# EAGLE design UPC2standalone2_Vadriano_capacitor_entrada (EAGLE 6.1)
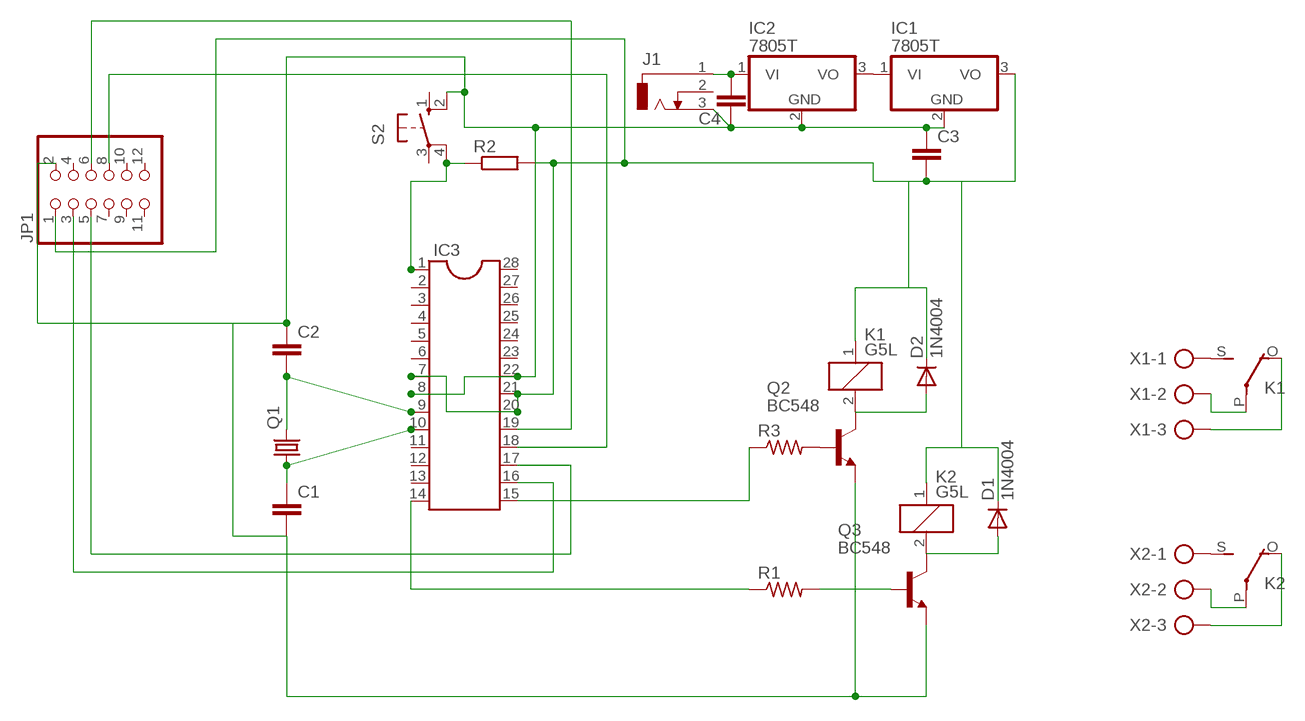
[diagram p0: schematic, sheet 1]

## Parts
C1  C5/5  [C5B5]
C2  C5/5  [C5B5]
C3  C5/5  [C5B5]
C4  C5/5  [C5B5]
D1  1N4004  [DO41-10]
D2  1N4004  [DO41-10]
IC1  7805T  [TO220H]
IC2  7805T  [TO220H]
IC3  DIL28-3  [DIL28-3]
J1  DCJ0303  [DCJ0303]
JP1  PINHD-2X6  [2X06]
K1  G5L  [G5LE]
K2  G5L  [G5LE]
Q1  CRYSTALHC49U70  [HC49U70]
Q2  BC548  [TO92-EBC]
Q3  BC548  [TO92-EBC]
R1  R-US_0207/10  [0207/10]
R2  R-EU_0207/10  [0207/10]
R3  R-US_0207/10  [0207/10]
S2  10-XX  [B3F-10XX]
X1  AK300/3  [AK300/3]
X2  AK300/3  [AK300/3]

## Nets
GND: C1.2 C2.1 C3.1 C4.1 IC1.2(GND) IC2.2(GND) IC3.8 IC3.22 J1.3 JP1.2 Q2.E Q3.E S2.2(S1)
N$1: IC3.18 JP1.8
N$2: C1.1 IC3.10 Q1.1
N$3: IC3.1 R2.1 S2.4(P1)
N$4: Q2.B R3.2
N$6: D2.A K1.2 Q2.C
N$7: IC3.16 JP1.3
N$8: IC3.19 JP1.6
N$9: IC3.17 JP1.5
N$10: D1.A K2.2 Q3.C
N$11: Q3.B R1.2
N$13: IC3.15 R3.1
N$14: IC1.1(VI) IC2.3(VO)
N$15: C3.2 D1.C D2.C IC1.3(VO) IC3.7 IC3.20 IC3.21 JP1.1 K1.1 K2.1 R2.2
N$17: IC3.14 R1.1
N$18: K1.S(2:S) X1.1
N$19: K2.S(2:S) X2.1
N$20: K2.P(2:P) X2.2
N$21: K2.O(2:O) X2.3
N$22: K1.P(2:P) X1.2
N$23: K1.O(2:O) X1.3
N$24: C4.2 IC2.1(VI) J1.1
N$27: C2.2 IC3.9 Q1.2
Unconnected: IC3.2 IC3.3 IC3.4 IC3.5 IC3.6 IC3.11 IC3.12 IC3.13 IC3.23 IC3.24 IC3.25 IC3.26 IC3.27 IC3.28 J1.2 JP1.4 JP1.7 JP1.9 JP1.10 JP1.11 JP1.12 S2.1(S) S2.3(P)

## Library data of the parts
C1-C4 = capacitor-wima:C: CAPACITOR naming: grid - package width
D1 D2 = adafruit:1N4004: DIODE General purpose 1N400x type rectifier (With bigger pads) http://www.ladyada.net/library/pcb/eaglelibrary.html
IC1 IC2 = linear:78*: Positive VOLTAGE REGULATOR Source: http://cache.national.com/ds/LM/LM78L05.pdf http://www.fairchildsemi.com/ds/LM/LM7805.pdf
IC3 = ic-package:DIL28: Dual In Line
J1 = con-jack:DCJ0303: DC POWER JACK Source: DCJ0303.pdf
JP1 = pinhead:PINHD-2X6: PIN HEADER
K1 K2 = relay:G5L: RELAY 1 x switch, 10 A/120 V AC, 8 A/30 V ADC, Omron
Q1 = crystal:CRYSTAL: CRYSTAL
Q2 Q3 = transistor-npn:BC548*: NPN Transistor
R1 R3 = adafruit:R-US_: RESISTOR, American symbol
R2 = rcl:R-EU_: RESISTOR, European symbol
S2 = switch-omron:10-XX: OMRON SWITCH
X1 X2 = con-ptr500:AK300/3: CONNECTOR

## Board
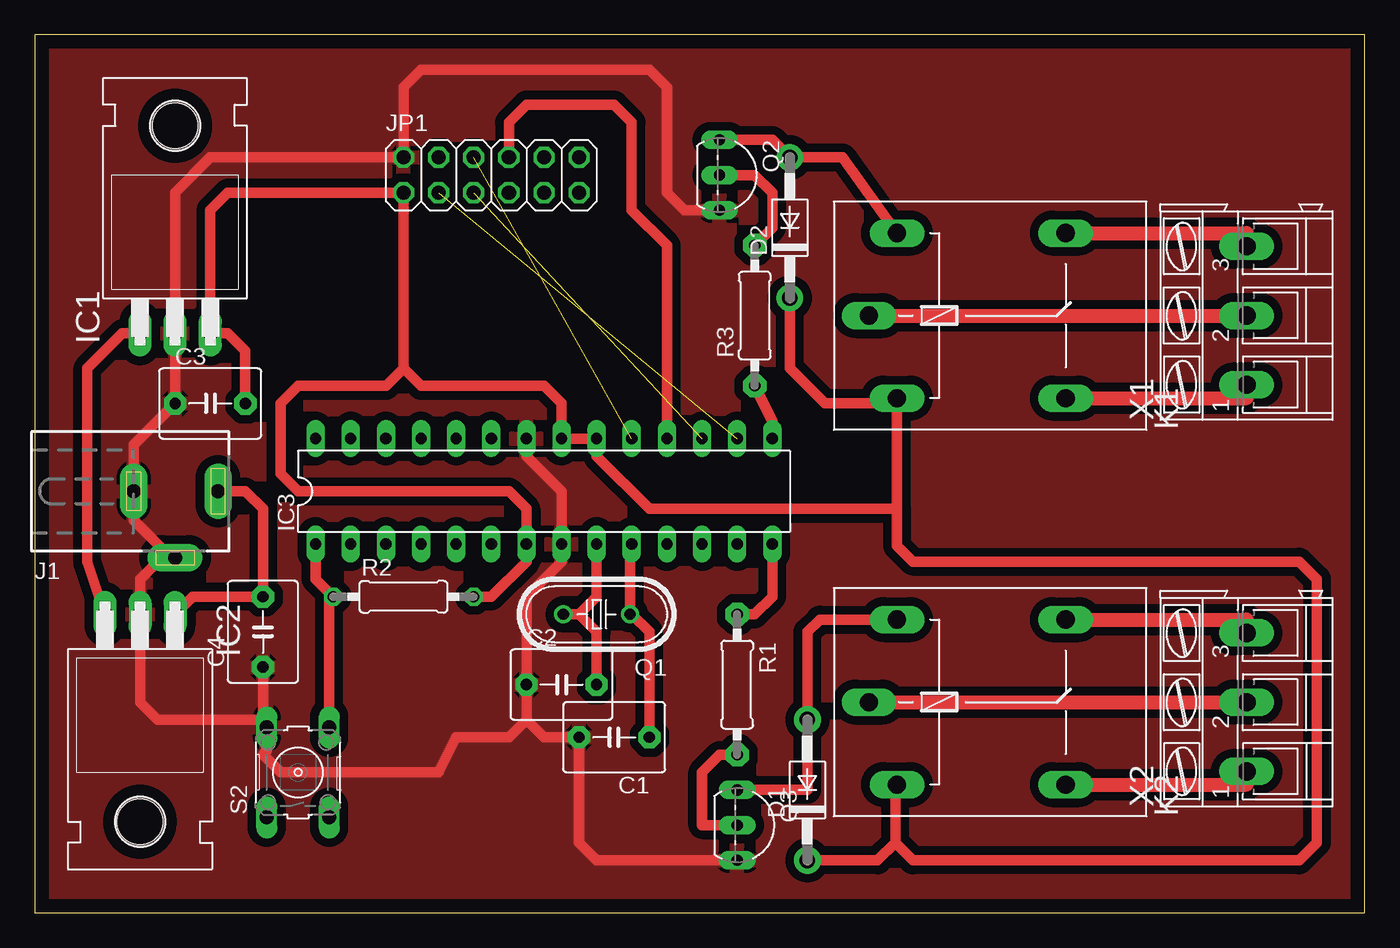
[diagram p1: board, top side]

Size 96.19 x 63.49 mm. Coordinates in mm from the lower left corner, seen from the top.
Outline: 0,0 96.19,0 96.19,63.49 0,63.49 0,0
Copper layers (1*16): Top 0.035mm / dielectric 1.5mm / Bottom 0.035mm
Design rules: minimum track width 30mil, minimum drill 24mil, track to track 25mil, track to pad 25mil, pad to pad 25mil, via to via 25mil, smd to smd 8mil, copper to edge 40mil, drill to drill 8mil, minimum pad ring 10mil, minimum via ring 8mil, stop-mask expansion 4mil, vias tented up to drill 0mil, thermal gap 10mil

### Footprints (pad centres in the part's own frame; a part is rotated, then mirrored left to right if it is on the bottom)
C5B5 = drill 0.813 pad 1.6 octagon: 1 -2.54,0; 2 2.54,0
DO41-10 = drill 1.118 pad 1.93: A 5.08,0; C -5.08,0
TO220H = drill 1.118 long: 1 -2.54,-10.16; 2 0,-10.16; 3 2.54,-10.16 | hole 3.302: 0,4.826
DIL28-3 = drill 0.813 long: 1 -16.51,-3.81; 2 -13.97,-3.81; 3 -11.43,-3.81; 4 -8.89,-3.81; 5 -6.35,-3.81; 6 -3.81,-3.81; 7 -1.27,-3.81; 8 1.27,-3.81; 9 3.81,-3.81; 10 6.35,-3.81; 11 8.89,-3.81; 12 11.43,-3.81; 13 13.97,-3.81; 14 16.51,-3.81; 15 16.51,3.81; 16 13.97,3.81; 17 11.43,3.81; 18 8.89,3.81; 19 6.35,3.81; 20 3.81,3.81; 21 1.27,3.81; 22 -1.27,3.81; 23 -3.81,3.81; 24 -6.35,3.81; 25 -8.89,3.81; 26 -11.43,3.81; 27 -13.97,3.81; 28 -16.51,3.81
DCJ0303 = drill 1 pad 2 long: 1 0,3.1; 2 4.8,0; 3 0,-3
2X06 = drill 1.016 octagon: 1 -6.35,-1.27; 2 -6.35,1.27; 3 -3.81,-1.27; 4 -3.81,1.27; 5 -1.27,-1.27; 6 -1.27,1.27; 7 1.27,-1.27; 8 1.27,1.27; 9 3.81,-1.27; 10 3.81,1.27; 11 6.35,-1.27; 12 6.35,1.27
G5LE = drill 1.321 long: 1 -7.493,-5.969; 2 -7.493,5.969; O 4.699,5.969; P -9.525,0; S 4.699,-5.969
HC49U70 = drill 0.813: 1 -2.413,0; 2 2.413,0
TO92-EBC = drill 0.813 long: B 0,-1.27; C -2.54,-1.27; E 2.54,-1.27
0207/10 = drill 0.813 pad 1.676 octagon: 1 -5.08,0; 2 5.08,0
0207/10' = drill 0.813 octagon: 1 -5.08,0; 2 5.08,0
B3F-10XX = drill 1.016 long: 1 -3.251,2.261; 2 3.251,2.261; 3 -3.251,-2.261; 4 3.251,-2.261
AK300/3 = drill 1.321 long: 1 -5.004,0; 2 0,0; 3 5.004,0

### Placement (x,y rotation side)
C1  41.91,12.7 180 top
C2  38.1,16.51 0 top
C3  12.7,36.83 0 top
C4  16.51,20.32 90 top
D1  55.88,8.89 90 top
D2  54.61,49.53 90 top
IC1  10.16,52.07 0 top
IC2  7.62,11.43 180 top
IC3  36.83,30.48 0 top
J1  10.16,30.48 270 top
JP1  33.02,53.34 0 top
K1  69.85,43.18 0 top
K2  69.85,15.24 0 top
Q1  40.64,21.59 180 top
Q2  50.8,53.34 270 top
Q3  52.07,6.35 270 top
R1  50.8,16.51 270 top
R2  [0207/10']  26.67,22.86 0 top
R3  52.07,43.18 90 top
S2  19.05,10.16 90 top
X1  87.63,43.18 90 top
X2  87.63,15.24 90 top

### Tracks (layer width: path | path; a pad name or v marks a point on that pad's centre or on a via)
GND
  Top 0.762: Q3.E 40.64,3.81 39.37,5.08 C1.2 36.83,12.7 35.56,13.97 | 35.56,13.97 C2.1 35.56,22.86 38.1,25.4 IC3.8 38.1,30.48 35.56,33.02 IC3.22 | Q2.E 46.99,50.8 45.72,52.07 45.72,59.69 44.45,60.96 27.94,60.96 26.67,59.69 JP1.2 12.7,54.61 10.16,52.07 IC1.2 C3.1 7.16,33.83 J1.3 7.16,28.4 10.16,25.4 8.89,25.4 7.62,24.13 IC2.2 7.62,15.24 8.89,13.97 16.51,13.97 C4.1 | S2.2 16.79,11.71 16.51,11.43 17.78,10.16 29.21,10.16 30.48,12.7 34.29,12.7 35.56,13.97
  pour Top: 0,63.5 96.52,63.5 96.52,0 0,0
N$1
  Top 0.762: IC3.18 45.72,48.26 43.18,50.8 43.18,57.15 41.91,58.42 35.56,58.42 34.29,57.15 JP1.8
N$2
  Top 0.762: C1.1 44.45,20.32 43.18,21.59 Q1.1 43.05,26.54 IC3.10
N$3
  Top 0.762: S2.4 21.31,22.58 R2.1 20.32,24.13 IC3.1
N$4
  Top 0.762: Q2.B 52.07,53.34 53.34,52.07 53.34,49.53 R3.2
N$6
  Top 0.762: K1.2 58.42,54.61 D2.A 53.34,55.88 Q2.C
N$7  (1 unrouted)
N$8  (1 unrouted)
N$9  (1 unrouted)
N$10
  Top 0.762: K2.2 56.77,21.21 55.88,20.32 D1.A 55.88,8.89 Q3.C
N$11
  Top 0.762: Q3.B 48.26,6.35 48.26,10.16 49.53,11.43 R1.2
N$13
  Top 0.762: R3.1 53.34,35.56 IC3.15
N$14
  Top 0.762: IC1.1 6.35,41.91 3.81,39.37 3.81,25.4 IC2.3
N$15
  Top 0.762: D1.C 60.96,3.81 62.23,5.08 | 62.23,5.08 62.23,9.14 K2.1 | R2.2 33.02,22.86 35.56,25.4 IC3.7 35.56,29.21 34.29,30.48 19.05,30.48 17.78,31.75 17.78,36.83 19.05,38.1 25.4,38.1 26.67,39.37 | C3.2 15.24,40.64 13.97,41.91 IC1.3 12.7,50.8 13.97,52.07 JP1.1 26.67,39.37 | 62.36,29.21 62.36,26.54 63.5,25.4 91.44,25.4 92.71,24.13 92.71,5.08 91.44,3.81 63.5,3.81 62.23,5.08 | 62.36,29.21 K1.1 61.98,36.83 57.15,36.83 54.61,39.37 D2.C | 26.67,39.37 27.94,38.1 36.83,38.1 38.1,36.83 IC3.21 IC3.20 40.64,33.02 44.45,29.21 62.36,29.21
N$17
  Top 0.762: R1.1 52.07,21.59 53.34,22.86 IC3.14
N$18
  Top 1.016: K1.S 87.63,37.21 X1.1
N$19
  Top 1.016: K2.S 87.63,9.27 X2.1
N$20
  Top 1.016: K2.P X2.2
N$21
  Top 1.016: K2.O 87.63,21.21 X2.3
N$22
  Top 1.016: K1.P X1.2
N$23
  Top 1.016: K1.O 87.63,49.15 X1.3
N$24
  Top 0.762: J1.1 15.24,30.48 16.51,29.21 C4.2 11.43,22.86 IC2.1
N$27
  Top 0.762: IC3.9 40.64,22.86 39.37,21.59 | 39.37,21.59 Q1.2 | 39.37,21.59 40.64,20.32 C2.2